# Altium schematic sheet ADC.SchDoc
size A
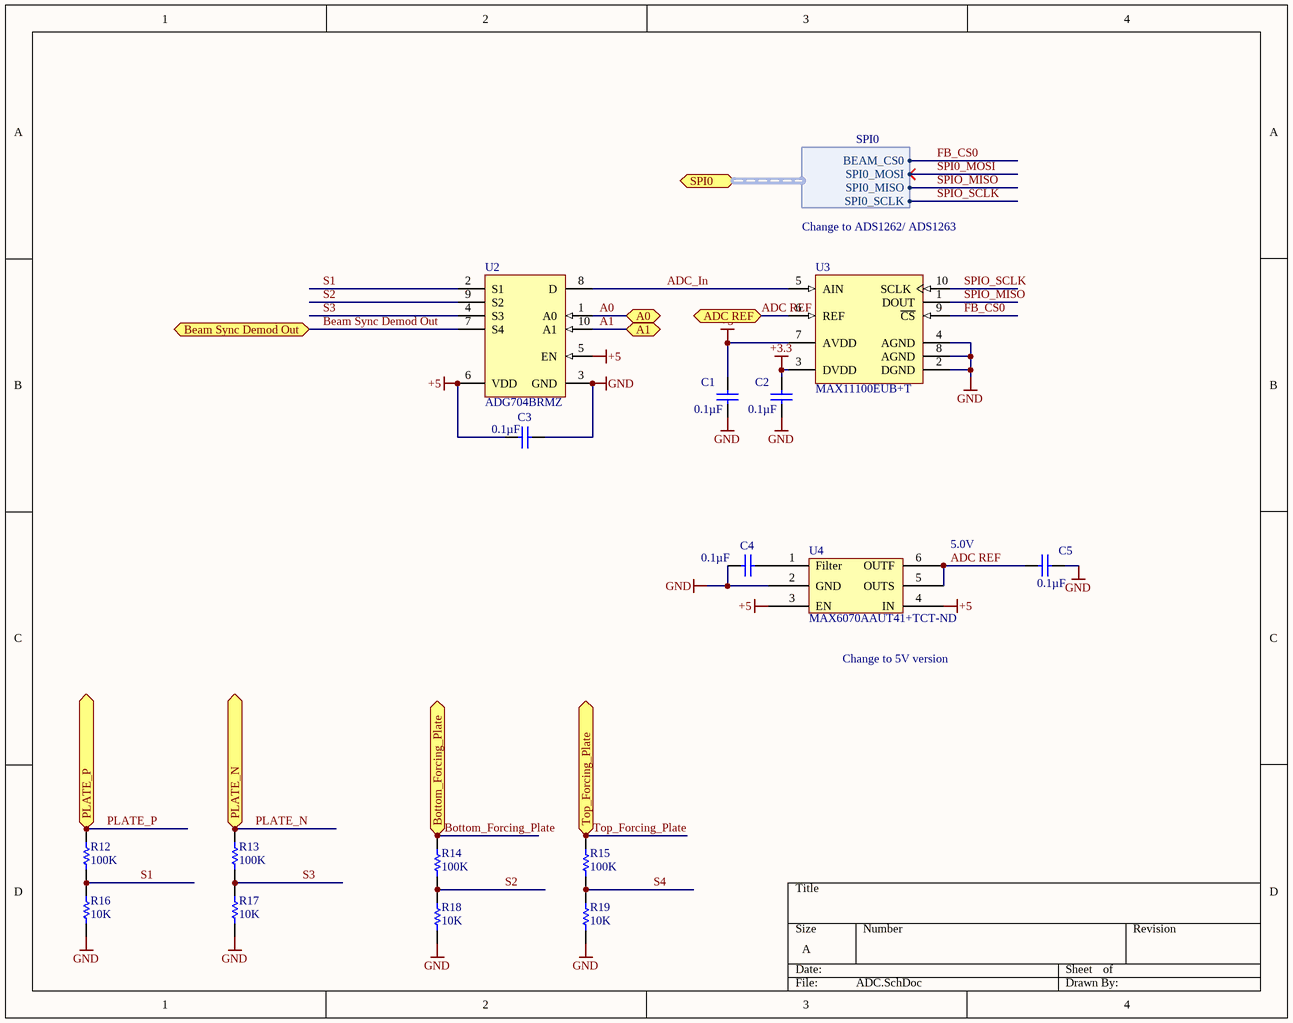
[diagram p0: ADC.SchDoc]

## Parts
C1  Capacitance: 0.1µF  [CAPC0805(2012)145_N]  (hidden comment: CAP CER 0.1UF 25V X7R 0805)
C2  Capacitance: 0.1µF  [CAPC0805(2012)145_N]  (hidden comment: CAP CER 0.1UF 25V X7R 0805)
C3  Capacitance: 0.1µF  [CAPC0805(2012)145_N]  (hidden comment: CAP CER 0.1UF 25V X7R 0805)
C4  Capacitance: 0.1µF  [CAPC0805(2012)145_N]  (hidden comment: CAP CER 0.1UF 25V X7R 0805)
C5  Capacitance: 0.1µF  [CAPC0805(2012)145_N]  (hidden comment: CAP CER 0.1UF 25V X7R 0805)
R12  100K  [RESC0402(1005)_M]
R13  100K  [RESC0402(1005)_M]
R14  100K  [RESC0402(1005)_M]
R15  100K  [RESC0402(1005)_M]
R16  10K  [RESC0402(1005)_M]
R17  10K  [RESC0402(1005)_M]
R18  10K  [RESC0402(1005)_M]
R19  10K  [RESC0402(1005)_M]
U2  ADG704BRMZ  [ADI-RM-10_L]
U3  MAX11100EUB+T  [U10+2_L]
U4  Supplier Part Number 1: MAX6070AAUT41+TCT-ND  [SOT95P280X445-6N]  (hidden comment: MAX6070AAUT41+T)

## Ports
A0, A1, ADC REF, Beam Sync Demod Out, Bottom_Forcing_Plate, PLATE_N, PLATE_P, SPI0 (harness SPI0), Top_Forcing_Plate

## Harnesses
SPI0: BEAM_CS0, SPI0_MOSI, SPI0_MISO, SPI0_SCLK

## Nets
+3.3: C2.1 U3.3(DVDD)
+5: C1.1 C3.1 U2.5(EN) U2.6(VDD) U3.7(AVDD) U4.3(EN) U4.4(IN)
GND: C1.2 C2.2 C3.2 C4.1 C5.2 R16.1 R17.1 R18.1 R19.1 U2.3(GND) U3.2(DGND) U3.4(AGND) U3.8(AGND) U4.2(GND)
A0: U2.1(A0) ; port A0
A1: U2.10(A1) ; port A1
ADC REF: C5.1 U3.6(REF) U4.5(OUTS) U4.6(OUTF) ; port ADC REF
ADC_In: U2.8(D) U3.5(AIN)
Beam Sync Demod Out: U2.7(S4) ; port Beam Sync Demod Out
Bottom_Forcing_Plate: R14.2 ; port Bottom_Forcing_Plate
FB_CS0: U3.9(~{CS}) ; port SPI0.BEAM_CS0
PLATE_N: R13.2 ; port PLATE_N
PLATE_P: R12.2 ; port PLATE_P
S1: R12.1 R16.2 U2.2(S1)
S2: R14.1 R18.2 U2.9(S2)
S3: R13.1 R17.2 U2.4(S3)
S4: R15.1 R19.2
SPI0_MOSI: port SPI0.SPI0_MOSI
SPIO_MISO: U3.1(DOUT) ; port SPI0.SPI0_MISO
SPIO_SCLK: U3.10(SCLK) ; port SPI0.SPI0_SCLK
Top_Forcing_Plate: R15.2 ; port Top_Forcing_Plate
NetC4_2: C4.2 U4.1(Filter)

## Notes on the sheet
- Change to ADS1262/ ADS1263
- 5.0V
- (near U4) Change to 5V version

## Library data of the parts
C1-C5 = CMP-1036-04795-1: Manufacturer: Murata Electronics North America; Manufacturer Part Number: GRM21BR71E104KA01L; Tolerance: ±10%; Supplier 1: Digi-Key; Supplier Part Number 1: 490-1673-6-ND; RoHS: RoHS Compliant; Category: Capacitors; Stock 1: 891652; Pricing 1: 1=0.2, 10=0.145, 100=0.0683, 500=0.04788, 1000=0.03964 (USD); Packaging: Digi-Reel®; Part Status: Active; Voltage - Rated: 25V; Temperature Coefficient: X7R; Operating Temperature: -55°C ~ 125°C; Features: -; Ratings: -; Applications: General Purpose; Mounting Type: Surface Mount, MLCC; Package / Case: 0805 (2012 Metric); Size / Dimension: 0.079" L x 0.049" W (2.00mm x 1.25mm); Height - Seated (Max): -; Thickness (Max): 0.053" (1.35mm); Lead Spacing: -; Lead Style: -; ComponentLink1URL: http://www.murata.com/~/media/webrenewal/support/library/catalog/products/capacitor/mlcc/c02e.ashx; ComponentLink1Description: http://www.murata.com/~/media/webrenewal/support/library/catalog/products/capacitor/mlcc/c02e.ashx
R12-R19 = CMP-1011-00463-1
U2 = CMP-0798-00103-1: CMOS Low Voltage 4 Ohm, 4-Channel Multiplexer, -40 to 85 degC, 10-pin SOP (RM-10), Tube; Manufacturer: Analog Devices; Bandwidth (Hz): 200M; Supply V Guar Performance: Single_(+3.3V), Single_(+3V), Single_(+5V); Ron (ohms): 4; Max Analog Signal Range: 0 to Vdd; PackageDescription: 10-Pin Mini Small Outline Package, Body 3 x 3 mm, Pitch 0.5 mm; PackageVersion: Aug-05; Packing: Tube; PartNumber: ADG704BRMZ; ComponentLink3Description: Package Specification; ComponentLink3URL: http://www.analog.com/static/imported-files/packages/PKG_PDF/MSOP%28RM%29/RM_10.pdf; ComponentLink2Description: Datasheet; ComponentLink1URL: http://www.analog.com/en/index.html; ComponentLink1Description: Manufacturer URL; ComponentLink2URL: http://www.analog.com/static/imported-files/data_sheets/ADG704.pdf; Mounting Technology: Surface Mount; DatasheetVersion: Rev. A; Code_JEDEC: MO-187-BA; PackageReference: RM-10
U3 = CMP-0249-00017-1: 16-Bit, +5V, 200ksps ADC with 10uA Shutdown, 10-Pin uMAX, -40°C to +85°C, Pb-Free, Tape and Reel; Manufacturer: Maxim Integrated; Number of Bits: 16; Sampling Rate (Per Second): 200k; Number of Inputs: 1; Input Type: Single Ended; Data Interface: SPI; Configuration: S/H-ADC; Ratio - S/H:ADC: 1:1; Architecture: SAR; Reference Type: External; Voltage - Supply, Analog: 5V; Voltage - Supply, Digital: 2.7 V ~ 5.25 V; Supplier 1: Digi-Key; Supplier Part Number 1: MAX11100EUB+-ND; Manufacturer Part Number: MAX11100EUB+; RoHS: RoHS Compliant; Category: Integrated Circuits (ICs); Stock 1: 927; Pricing 1: 1=5.98, 10=5.855 (USD); Packaging: Tube; Part Status: Active; Features: -; Operating Temperature: -40°C ~ 85°C; Package / Case: 10-TFSOP, 10-MSOP (0.118", 3.00mm Width); Supplier Device Package: 10-uMAX; Base Part Number: MAX11100; ComponentLink1URL: https://datasheets.maximintegrated.com/en/ds/MAX11100.pdf; ComponentLink1Description: https://datasheets.maximintegrated.com/en/ds/MAX11100.pdf
U4 = MAX6070AAUT41+T: IC VREF SERIES 4.096V SOT23; Manufacturer: Maxim Integrated; Output Type: Fixed; Tolerance: ±0.04%; Temperature Coefficient: 6ppm/°C; Noise - 0.1Hz to 10Hz: 9.6µVp-p; Noise - 10Hz to 10kHz: 9µVrms; Voltage - Input: 4.3 V ~ 5.5 V; Current - Supply: 350µA; Supplier 1: Digi-Key; Manufacturer Part Number: MAX6070AAUT41+T; RoHS: RoHS Compliant; Category: Integrated Circuits (ICs); Stock 1: 2623; Pricing 1: 1=3.41, 10=3.213, 25=2.5704, 50=2.4418, 100=2.2491, 250=2.13344, 500=2.05634 (USD); Packaging: Cut Tape (CT); Part Status: Active; Reference Type: Series; Voltage - Output (Min/Fixed): 4.096V; Operating Temperature: -40°C ~ 125°C (TA); Mounting Type: Surface Mount; Package / Case: SOT-23-6; Supplier Device Package: SOT-23-6; ComponentLink1URL: https://datasheets.maximintegrated.com/en/ds/MAX6070-MAX6071.pdf; ComponentLink1Description: https://datasheets.maximintegrated.com/en/ds/MAX6070-MAX6071.pdf